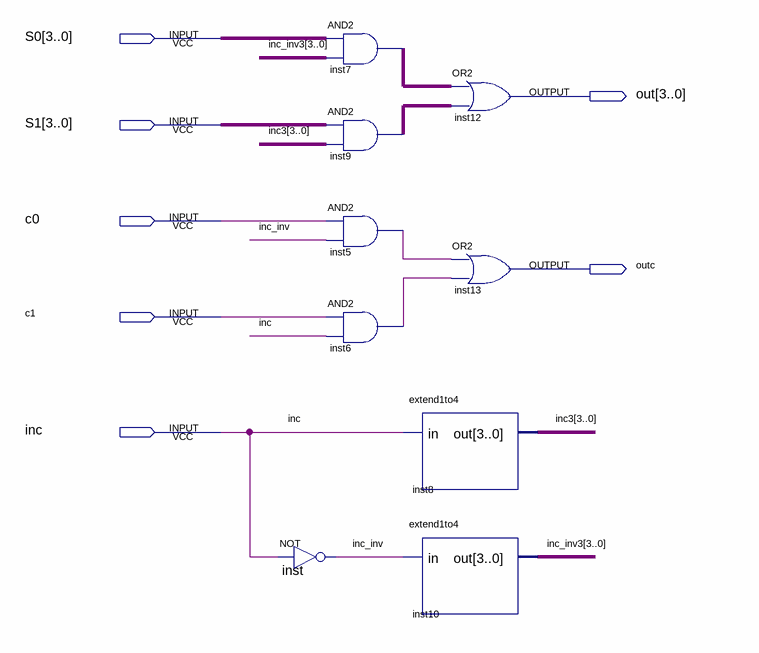
[diagram p0: schematic sheet]
// Quartus schematic carry_select_adder_mux.bdf as structural Verilog: 9 symbols, 7 pins
module carry_select_adder_mux (
  input  [3:0] S0,
  input  [3:0] S1,
  input  c0,
  input  c1,
  input  inc,
  output [3:0] out,
  output outc
);

  wire inc_inv, inst5_out, inst6_out;
  wire [3:0] inc3, inc_inv3, inst7_out, inst9_out;

  not inst (inc_inv, inc);
  assign inst7_out = S0 & inc_inv3;  // AND2 inst7, 4 bits wide
  assign inst9_out = S1 & inc3;  // AND2 inst9, 4 bits wide
  and inst5 (inst5_out, c0, inc_inv);
  and inst6 (inst6_out, c1, inc);
  assign out = inst7_out | inst9_out;  // OR2 inst12, 4 bits wide
  or inst13 (outc, inst5_out, inst6_out);
  extend1to4 inst8 (.in(inc), .out(inc3));
  extend1to4 inst10 (.in(inc_inv), .out(inc_inv3));
endmodule
